# EAGLE design 4-layer-cpwg-nomask-osh (EAGLE 9.4.1)
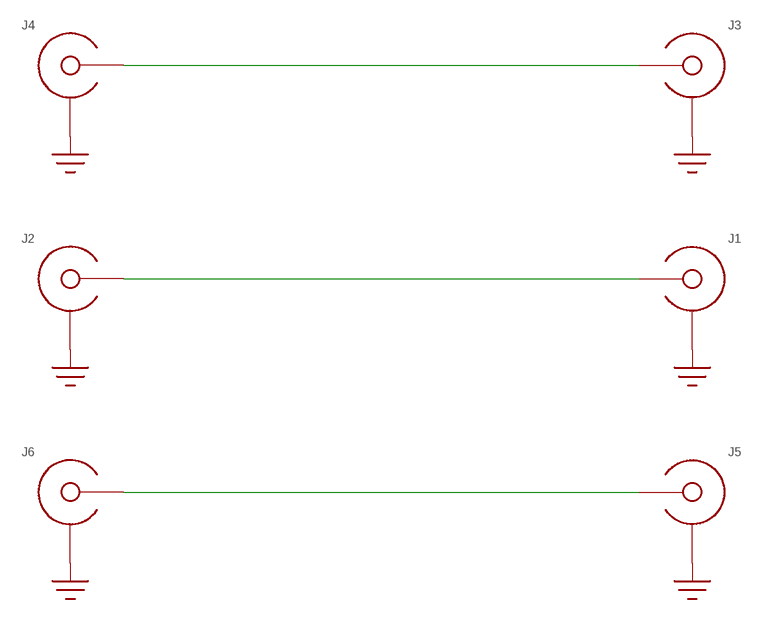
[diagram p0: schematic, sheet 1]

## Parts
J1  SMA-EDGE-LAUNCH4L-4020-TAPER-FIXED  [SMA_EDGE_LAUNCH_4L_4020_TAPER_FIXED]
J2  SMA-EDGE-LAUNCH4L-4020-TAPER-FIXED  [SMA_EDGE_LAUNCH_4L_4020_TAPER_FIXED]
J3  SMA-EDGE-LAUNCH4L-4020-TAPER-FIXED  [SMA_EDGE_LAUNCH_4L_4020_TAPER_FIXED]
J4  SMA-EDGE-LAUNCH4L-4020-TAPER-FIXED  [SMA_EDGE_LAUNCH_4L_4020_TAPER_FIXED]
J5  SMA-EDGE-LAUNCH4L-4020-TAPER-FIXED  [SMA_EDGE_LAUNCH_4L_4020_TAPER_FIXED]
J6  SMA-EDGE-LAUNCH4L-4020-TAPER-FIXED  [SMA_EDGE_LAUNCH_4L_4020_TAPER_FIXED]

## Nets
GND: J1.BOTTOM_GND(SHIELD) J1.GND@1(SHIELD) J1.GND@2(SHIELD) J1.GND@3(SHIELD) J1.GND@4(SHIELD) J1.GND@5(SHIELD) J1.GND@6(SHIELD) J1.GND@7(SHIELD) J1.GND@8(SHIELD) J1.GND@14(SHIELD) J1.GND@15(SHIELD) J1.GND@16(SHIELD) J1.GND@17(SHIELD) J1.GND_PAD1(SHIELD) J1.GND_PAD2(SHIELD) J1.P$1(SHIELD) J1.P$2(SHIELD) J2.BOTTOM_GND(SHIELD) J2.GND@1(SHIELD) J2.GND@2(SHIELD) J2.GND@3(SHIELD) J2.GND@4(SHIELD) J2.GND@5(SHIELD) J2.GND@6(SHIELD) J2.GND@7(SHIELD) J2.GND@8(SHIELD) J2.GND@14(SHIELD) J2.GND@15(SHIELD) J2.GND@16(SHIELD) J2.GND@17(SHIELD) J2.GND_PAD1(SHIELD) J2.GND_PAD2(SHIELD) J2.P$1(SHIELD) J2.P$2(SHIELD) J3.BOTTOM_GND(SHIELD) J3.GND@1(SHIELD) J3.GND@2(SHIELD) J3.GND@3(SHIELD) J3.GND@4(SHIELD) J3.GND@5(SHIELD) J3.GND@6(SHIELD) J3.GND@7(SHIELD) J3.GND@8(SHIELD) J3.GND@14(SHIELD) J3.GND@15(SHIELD) J3.GND@16(SHIELD) J3.GND@17(SHIELD) J3.GND_PAD1(SHIELD) J3.GND_PAD2(SHIELD) J3.P$1(SHIELD) J3.P$2(SHIELD) J4.BOTTOM_GND(SHIELD) J4.GND@1(SHIELD) J4.GND@2(SHIELD) J4.GND@3(SHIELD) J4.GND@4(SHIELD) J4.GND@5(SHIELD) J4.GND@6(SHIELD) J4.GND@7(SHIELD) J4.GND@8(SHIELD) J4.GND@14(SHIELD) J4.GND@15(SHIELD) J4.GND@16(SHIELD) J4.GND@17(SHIELD) J4.GND_PAD1(SHIELD) J4.GND_PAD2(SHIELD) J4.P$1(SHIELD) J4.P$2(SHIELD) J5.BOTTOM_GND(SHIELD) J5.GND@1(SHIELD) J5.GND@2(SHIELD) J5.GND@3(SHIELD) J5.GND@4(SHIELD) J5.GND@5(SHIELD) J5.GND@6(SHIELD) J5.GND@7(SHIELD) J5.GND@8(SHIELD) J5.GND@14(SHIELD) J5.GND@15(SHIELD) J5.GND@16(SHIELD) J5.GND@17(SHIELD) J5.GND_PAD1(SHIELD) J5.GND_PAD2(SHIELD) J5.P$1(SHIELD) J5.P$2(SHIELD) J6.BOTTOM_GND(SHIELD) J6.GND@1(SHIELD) J6.GND@2(SHIELD) J6.GND@3(SHIELD) J6.GND@4(SHIELD) J6.GND@5(SHIELD) J6.GND@6(SHIELD) J6.GND@7(SHIELD) J6.GND@8(SHIELD) J6.GND@14(SHIELD) J6.GND@15(SHIELD) J6.GND@16(SHIELD) J6.GND@17(SHIELD) J6.GND_PAD1(SHIELD) J6.GND_PAD2(SHIELD) J6.P$1(SHIELD) J6.P$2(SHIELD)
N$1 [13-6]: J1.CENTER@1(CENTER) J1.P$3(CENTER) J2.CENTER@1(CENTER) J2.P$3(CENTER)
N$2 [13.5-6]: J3.CENTER@1(CENTER) J3.P$3(CENTER) J4.CENTER@1(CENTER) J4.P$3(CENTER)
N$3 [14-6]: J5.CENTER@1(CENTER) J5.P$3(CENTER) J6.CENTER@1(CENTER) J6.P$3(CENTER)

## Library data of the parts
J1-J6 = yapo:SMA-EDGE-LAUNCH

## Net classes
1 50-ohm: clearance 2.54 mm
2 13-6: width 0.33 mm, clearance 0.152 mm
3 13.5-6: width 0.343 mm, clearance 0.152 mm
4 14-6: width 0.356 mm, clearance 0.152 mm

## Board
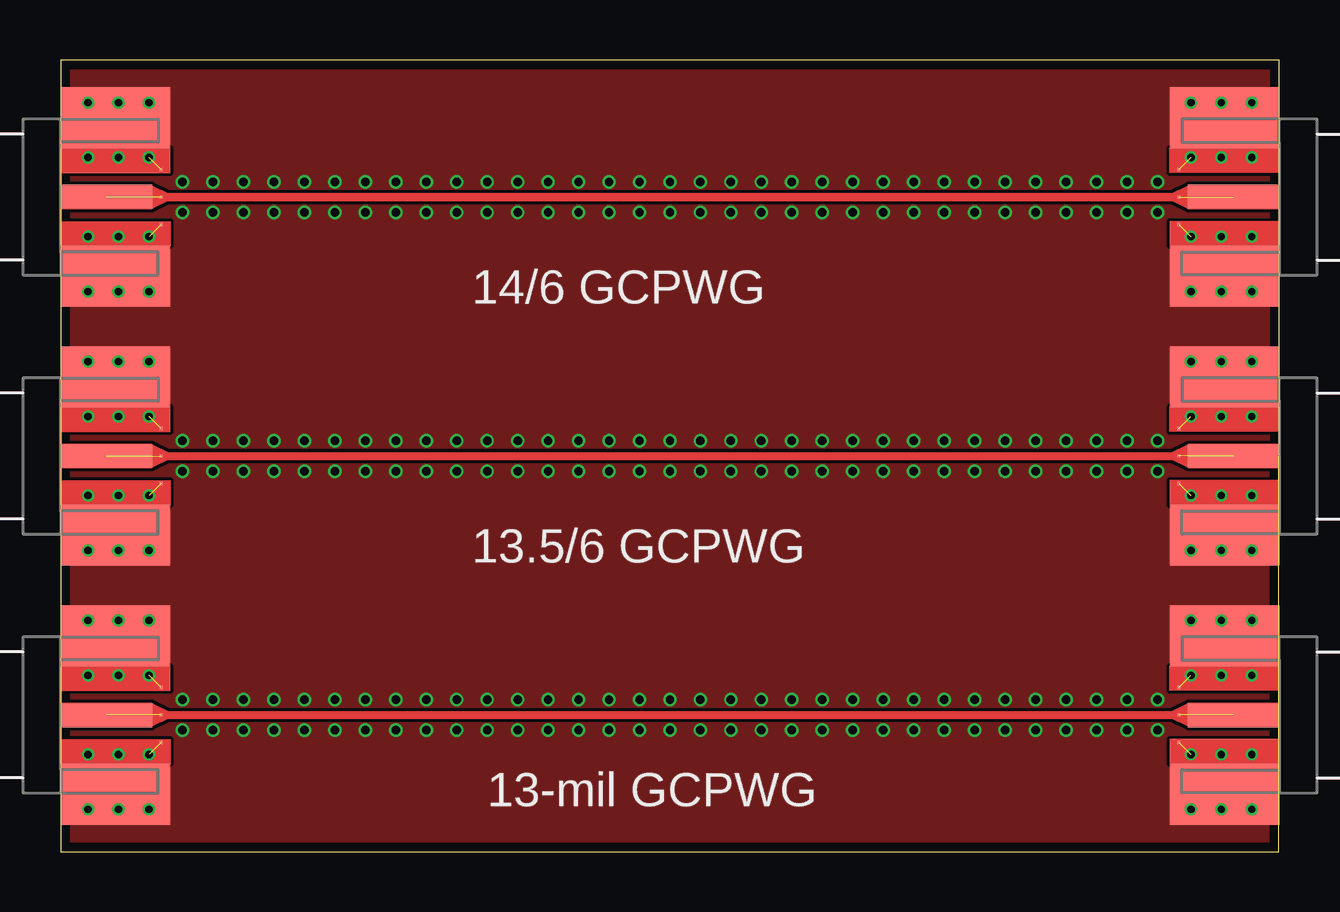
[diagram p1: board, top side]
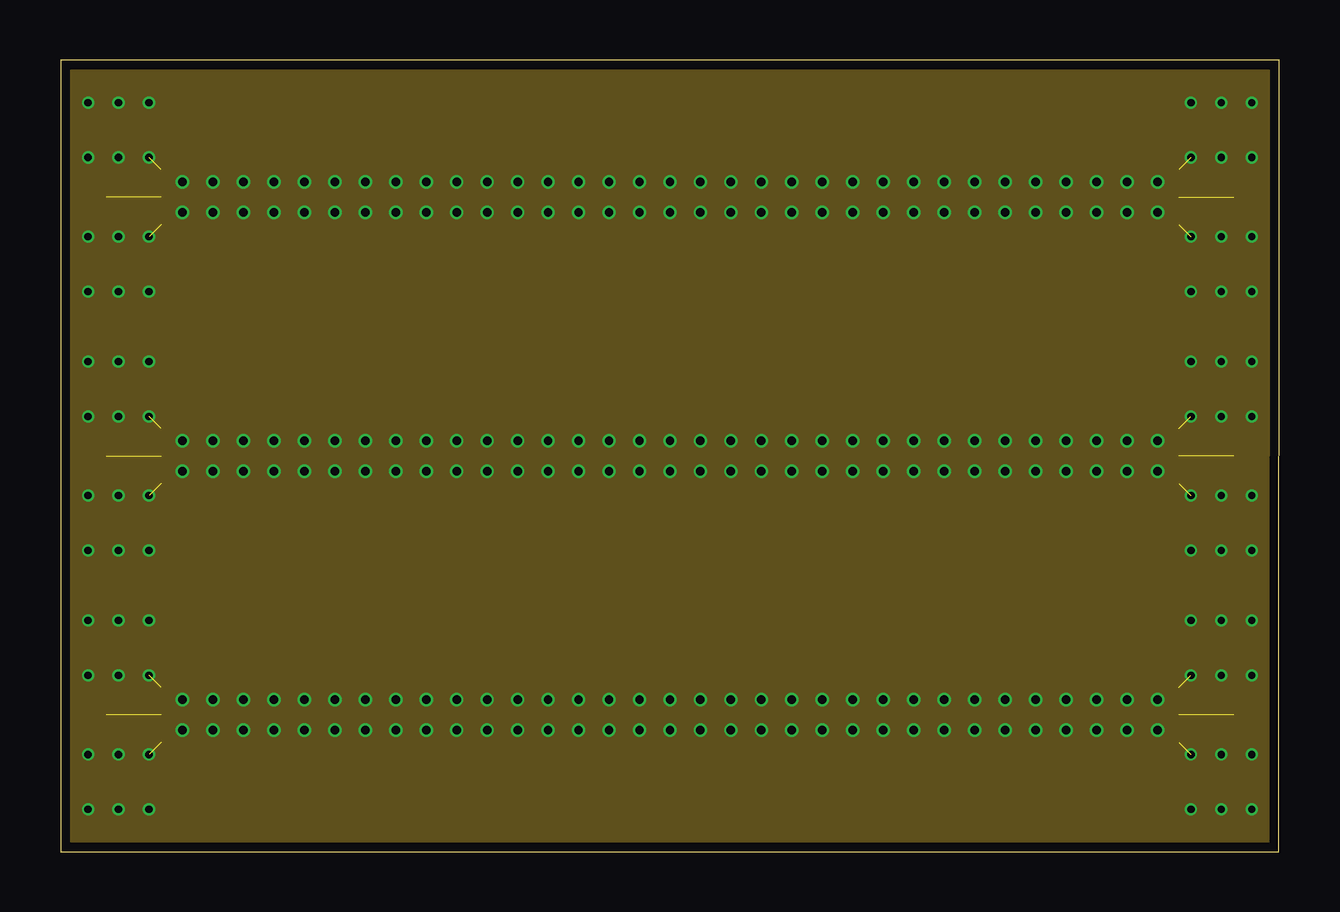
[diagram p2: board, inner layer Route2]
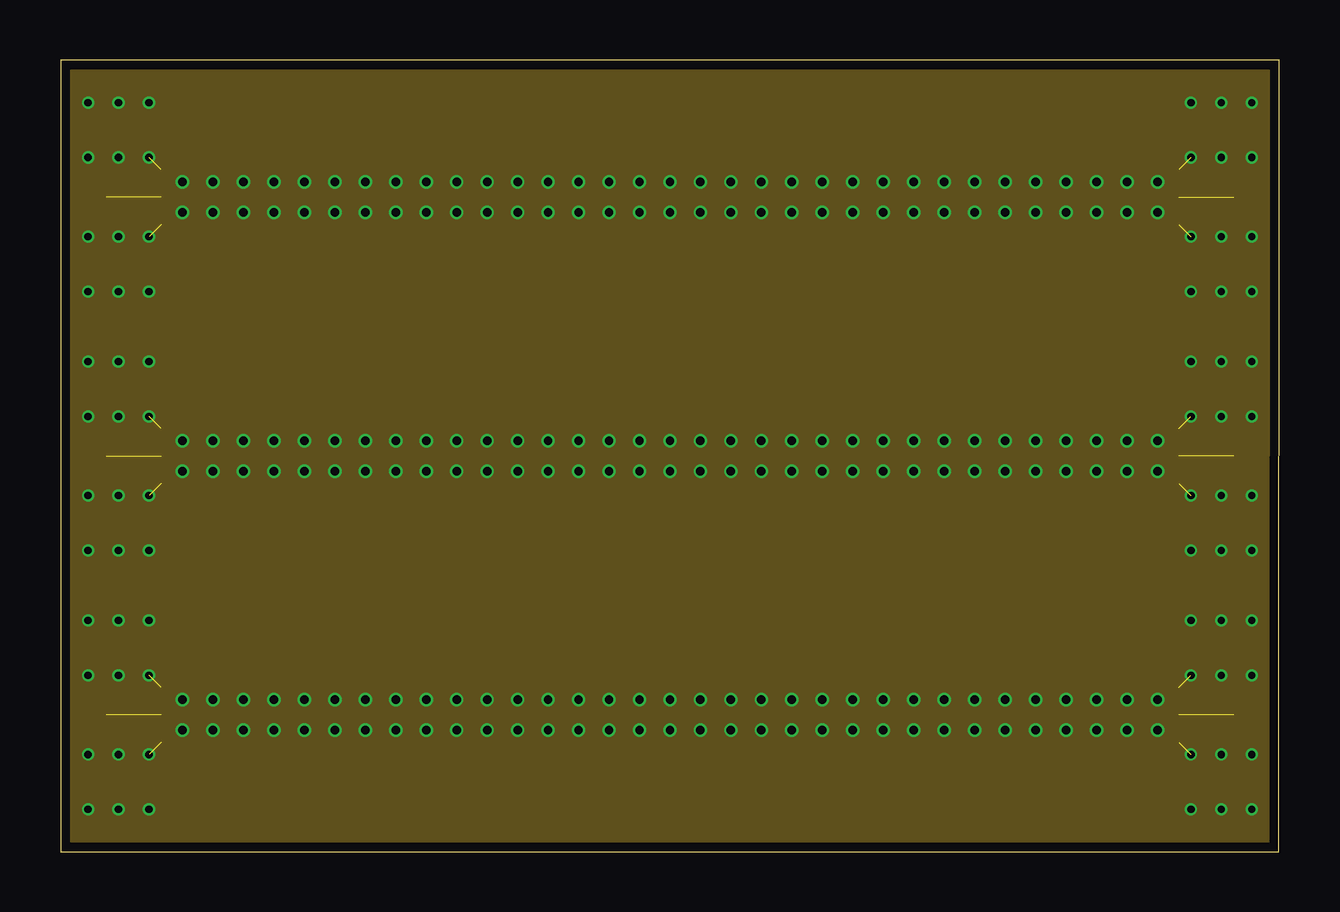
[diagram p3: board, inner layer Route15]
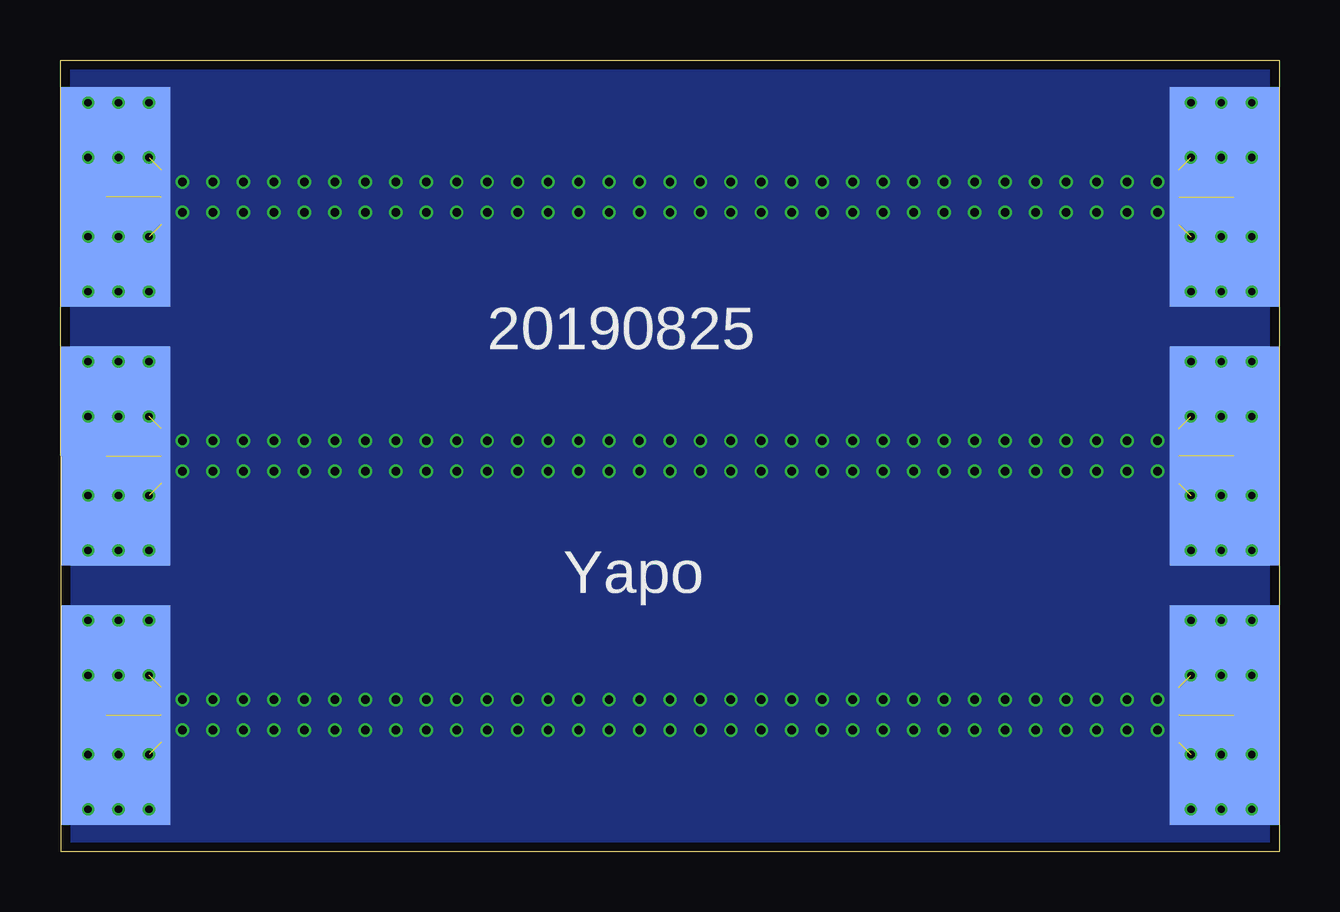
[diagram p4: board, bottom side, seen from below]

Size 50.8 x 33.02 mm. Coordinates in mm from the lower left corner, seen from the top.
Outline: 0,0 50.78,0 50.8,33.02 0,33.02 0,0
Copper layers (1*2*15*16): Top 0.035559375mm / dielectric 0.17018125mm / Route2 0.01778125mm / dielectric 47mil / Route15 0.01778125mm / dielectric 0.17018125mm / Bottom 0.035559375mm
Design rules "oshpark-4layer *": minimum track width 5mil, minimum drill 10mil, track to track 5mil, track to pad 5mil, pad to pad 5mil, via to via 5mil, smd to smd 5mil, copper to edge 15mil, drill to drill 6mil, minimum pad ring 4mil, minimum via ring 4mil, stop-mask expansion 2.5mil, vias tented up to drill 20mil, thermal gap 10mil

### Footprints (pad centres in the part's own frame; a part is rotated, then mirrored left to right if it is on the bottom)
SMA_EDGE_LAUNCH_4L_4020_TAPER_FIXED = smd 4.572 x 9.144 bottom: BOTTOM_GND 2.286,0 | smd 3.81 x 1.016: CENTER@1 1.905,0 | drill 0.3: GND@1 1.143,3.937; GND@2 3.683,3.937; GND@3 1.143,1.651; GND@4 3.683,1.651; GND@5 1.143,-1.651; GND@6 3.683,-1.651; GND@7 1.143,-3.937; GND@8 3.683,-3.937; GND@14 2.413,3.937; GND@15 2.413,-3.937; GND@16 2.413,-1.651; GND@17 2.413,1.651 | smd 4.572 x 2.54: GND_PAD1 2.286,3.302; GND_PAD2 2.286,-3.302 | smd 0.127 x 0.127: P$1 4.191,1.143; P$2 4.191,-1.143; P$3 4.191,0

### Placement (x,y rotation side)
J1  50.8,5.71 180 top
J2  0,5.71 0 top
J3  0,16.51 0 top
J4  50.8,16.51 180 top
J5  0,27.3 0 top
J6  50.8,27.3 180 top

### Tracks (layer width: path | path; a pad name or v marks a point on that pad's centre or on a via)
GND  (via drill 0.35)  (12 unrouted)
  other vias: 5.08,27.94 6.35,27.94 7.62,27.94 8.89,27.94 10.16,27.94 11.43,27.94 12.7,27.94 13.97,27.94 15.24,27.94 16.51,27.94 17.78,27.94 19.05,27.94 20.32,27.94 21.59,27.94 22.86,27.94 24.13,27.94 25.4,27.94 26.67,27.94 27.94,27.94 29.21,27.94 30.48,27.94 31.75,27.94 33.02,27.94 34.29,27.94 35.56,27.94 36.83,27.94 38.1,27.94 39.37,27.94 40.64,27.94 41.91,27.94 43.18,27.94 44.45,27.94 45.72,27.94 5.08,26.67 6.35,26.67 7.62,26.67 8.89,26.67 10.16,26.67 11.43,26.67 12.7,26.67 13.97,26.67 15.24,26.67 16.51,26.67 17.78,26.67 19.05,26.67 20.32,26.67 21.59,26.67 22.86,26.67 24.13,26.67 25.4,26.67 26.67,26.67 27.94,26.67 29.21,26.67 30.48,26.67 31.75,26.67 33.02,26.67 34.29,26.67 35.56,26.67 36.83,26.67 38.1,26.67 39.37,26.67 40.64,26.67 41.91,26.67 43.18,26.67 44.45,26.67 45.72,26.67 5.08,17.14 6.35,17.14 7.62,17.14 8.89,17.14 10.16,17.14 11.43,17.14 12.7,17.14 13.97,17.14 15.24,17.14 16.51,17.14 17.78,17.14 19.05,17.14 20.32,17.14 21.59,17.14 22.86,17.14 24.13,17.14 25.4,17.14 26.67,17.14 27.94,17.14 29.21,17.14 30.48,17.14 31.75,17.14 33.02,17.14 34.29,17.14 35.56,17.14 36.83,17.14 38.1,17.14 39.37,17.14 40.64,17.14 41.91,17.14 43.18,17.14 44.45,17.14 45.72,17.14 5.08,15.88 6.35,15.88 7.62,15.88 8.89,15.88 10.16,15.88 11.43,15.88 12.7,15.88 13.97,15.88 15.24,15.88 16.51,15.88 17.78,15.88 19.05,15.88 20.32,15.88 21.59,15.88 22.86,15.88 24.13,15.88 25.4,15.88 26.67,15.88 27.94,15.88 29.21,15.88 30.48,15.88 31.75,15.88 33.02,15.88 34.29,15.88 35.56,15.88 36.83,15.88 38.1,15.88 39.37,15.88 40.64,15.88 41.91,15.88 43.18,15.88 44.45,15.88 45.72,15.88 5.08,6.35 6.35,6.35 7.62,6.35 8.89,6.35 10.16,6.35 11.43,6.35 12.7,6.35 13.97,6.35 15.24,6.35 16.51,6.35 17.78,6.35 19.05,6.35 20.32,6.35 21.59,6.35 22.86,6.35 24.13,6.35 25.4,6.35 26.67,6.35 27.94,6.35 29.21,6.35 30.48,6.35 31.75,6.35 33.02,6.35 34.29,6.35 35.56,6.35 36.83,6.35 38.1,6.35 39.37,6.35 40.64,6.35 41.91,6.35 43.18,6.35 44.45,6.35 45.72,6.35 5.08,5.08 6.35,5.08 7.62,5.08 8.89,5.08 10.16,5.08 11.43,5.08 12.7,5.08 13.97,5.08 15.24,5.08 16.51,5.08 17.78,5.08 19.05,5.08 20.32,5.08 21.59,5.08 22.86,5.08 24.13,5.08 25.4,5.08 26.67,5.08 27.94,5.08 29.21,5.08 30.48,5.08 31.75,5.08 33.02,5.08 34.29,5.08 35.56,5.08 36.83,5.08 38.1,5.08 39.37,5.08 40.64,5.08 41.91,5.08 43.18,5.08 44.45,5.08 45.72,5.08
  pour Top (no thermals): 0,0 50.8,0 50.8,33.02 0,33.02
  pour Route2 (no thermals): 0,0 50.8,0 50.8,33.02 0,33.02
  pour Bottom (no thermals): 0,0 50.8,0 50.8,33.02 0,33.02
  pour Route15 (no thermals): 0,0 50.8,0 50.8,33.02 0,33.02
N$1  (2 unrouted)
  Top 0.33: J2.CENTER@1 J1.CENTER@1
N$2  (2 unrouted)
  Top 0.343: J3.P$3 J4.CENTER@1
N$3  (3 unrouted)
  Top 0.356: J5.CENTER@1 48.26,27.3

### Text on the board
tPlace: 14/6 GCPWG | 13.5/6 GCPWG | 13-mil GCPWG
bPlace: 20190825 | Yapo